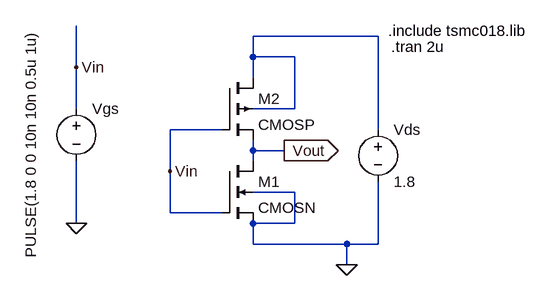
[diagram p0: schematic Inverter.asc]
Inverter.asc, the LTspice schematic file:
Version 4
SHEET 1 880 680
WIRE 384 -32 192 -32
WIRE 192 0 192 -32
WIRE 256 0 192 0
WIRE -80 16 -80 -48
WIRE 192 32 192 0
WIRE -80 80 -80 16
WIRE 256 80 256 0
WIRE 256 80 192 80
WIRE 144 112 64 112
WIRE 384 112 384 -32
WIRE 192 144 192 128
WIRE 240 144 192 144
WIRE 192 160 192 144
WIRE 64 176 64 112
WIRE 256 208 192 208
WIRE 64 240 64 176
WIRE 144 240 64 240
WIRE -80 256 -80 160
WIRE 256 256 256 208
WIRE 256 256 192 256
WIRE 192 288 192 256
WIRE 336 288 192 288
WIRE 384 288 384 192
WIRE 384 288 336 288
WIRE 336 320 336 288
FLAG -80 256 0
FLAG 336 320 0
FLAG 240 144 Vout
IOPIN 240 144 Out
FLAG -80 16 Vin
FLAG 64 176 Vin
SYMBOL cmosn 144 160 R0
SYMATTR InstName M1
SYMATTR Value2 l=180n w=1u
SYMBOL cmosp 144 32 R0
SYMATTR InstName M2
SYMATTR Value2 l=180n w=1200n
SYMBOL voltage -80 64 R0
WINDOW 3 -70 245 VLeft 2
WINDOW 123 0 0 Left 0
WINDOW 39 0 0 Left 0
SYMATTR InstName Vgs
SYMATTR Value PULSE(1.8 0 0 10n 10n 0.5u 1u)
SYMBOL voltage 384 96 R0
WINDOW 123 0 0 Left 0
WINDOW 39 0 0 Left 0
SYMATTR InstName Vds
SYMATTR Value 1.8
TEXT 400 -40 Left 2 !.include tsmc018.lib
TEXT 404 -16 Left 2 !.tran 2u

The netlist it stands for:
* Inverter.asc
M1 Vout Vin 0 0 CMOSN l=180n w=1u
M2 N001 Vin Vout N001 CMOSP l=180n w=1200n
Vgs Vin 0 PULSE(1.8 0 0 10n 10n 0.5u 1u)
Vds N001 0 1.8
.model NMOS NMOS
.model PMOS PMOS
.lib standard.mos
.include tsmc018.lib
.tran 2u
.backanno
.end